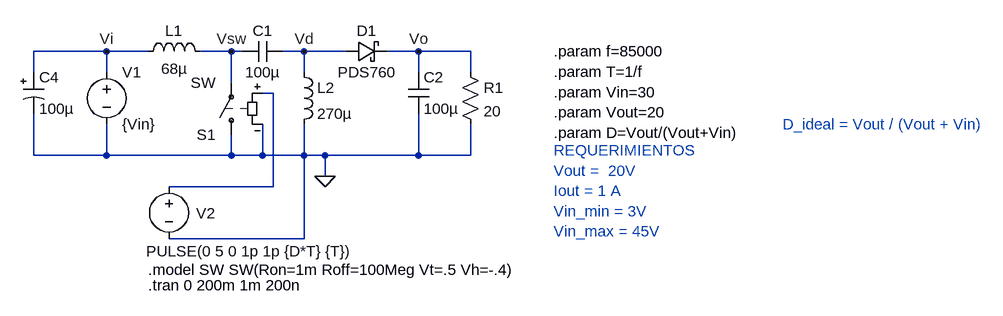
[diagram p0: schematic sepic_20W_3.asc]
sepic_20W_3.asc, the LTspice schematic file:
Version 4.1
SHEET 1 1356 680
WIRE -32 96 -144 96
WIRE 32 96 -32 96
WIRE 160 96 112 96
WIRE 176 96 160 96
WIRE 272 96 240 96
WIRE 336 96 272 96
WIRE 448 96 400 96
WIRE 528 96 448 96
WIRE -144 128 -144 96
WIRE -32 128 -32 96
WIRE 272 128 272 96
WIRE 448 128 448 96
WIRE 528 128 528 96
WIRE 160 144 160 96
WIRE 224 160 208 160
WIRE -144 256 -144 192
WIRE -32 256 -32 208
WIRE -32 256 -144 256
WIRE 160 256 160 224
WIRE 160 256 -32 256
WIRE 208 256 208 208
WIRE 208 256 160 256
WIRE 272 256 272 208
WIRE 272 256 208 256
WIRE 304 256 272 256
WIRE 448 256 448 192
WIRE 448 256 304 256
WIRE 528 256 528 208
WIRE 528 256 448 256
WIRE 304 288 304 256
WIRE 224 304 224 160
WIRE 224 304 64 304
WIRE 272 384 272 256
WIRE 272 384 64 384
FLAG 304 288 0
FLAG 448 96 Vo
FLAG -32 96 Vi
FLAG 160 96 Vsw
FLAG 272 96 Vd
SYMBOL voltage -32 112 R0
WINDOW 123 0 0 Left 0
WINDOW 39 0 0 Left 0
SYMATTR InstName V1
SYMATTR Value {Vin}
SYMBOL res 512 112 R0
SYMATTR InstName R1
SYMATTR Value 20
SYMBOL ind 16 112 R270
WINDOW 0 32 56 VTop 2
WINDOW 3 5 56 VBottom 2
SYMATTR InstName L1
SYMATTR Value 68µ
SYMATTR SpiceLine Rser=1m
SYMBOL ind 256 112 R0
SYMATTR InstName L2
SYMATTR Value 270µ
SYMATTR SpiceLine Rser=1m
SYMBOL schottky 336 112 R270
WINDOW 0 32 32 VTop 2
WINDOW 3 0 32 VBottom 2
SYMATTR InstName D1
SYMATTR Value PDS760
SYMATTR Description Diode
SYMATTR Type diode
SYMBOL cap 240 80 R90
WINDOW 0 0 32 VBottom 2
WINDOW 3 32 32 VTop 2
SYMATTR InstName C1
SYMATTR Value 100µ
SYMBOL voltage 64 288 R0
WINDOW 0 42 57 Left 2
WINDOW 3 -35 115 Left 2
WINDOW 123 0 0 Left 0
WINDOW 39 0 0 Left 0
SYMATTR InstName V2
SYMATTR Value PULSE(0 5 0 1p 1p {D*T} {T})
SYMBOL sw 160 240 R180
SYMATTR InstName S1
SYMBOL polcap -160 128 R0
SYMATTR InstName C4
SYMATTR Value 100µ
SYMATTR Description Capacitor
SYMATTR Type cap
SYMATTR SpiceLine V=25 Irms=1.29 Rser=0.15 Lser=0 mfg="Vishay" pn="TR3W107M025" type="Tantalum"
SYMBOL cap 432 128 R0
SYMATTR InstName C2
SYMATTR Value 100µ
TEXT 32 456 Left 2 !.tran 0 200m 1m 200n
TEXT 32 432 Left 2 !.model SW SW(Ron=1m Roff=100Meg Vt=.5 Vh=-.4)
TEXT 656 96 Left 2 !.param f=85000\n.param T=1/f\n.param Vin=30\n.param Vout=20\n.param D=Vout/(Vout+Vin)
TEXT 1008 208 Left 2 ;D_ideal = Vout / (Vout + Vin)
TEXT 656 248 Left 2 ;REQUERIMIENTOS\nVout =  20V\nIout = 1 A\nVin_min = 3V\nVin_max = 45V

The netlist it stands for:
* sepic_20W_3.asc
V1 Vi 0 {Vin}
R1 Vo 0 20
L1 Vi Vsw 68µ Rser=1m
L2 Vd 0 270µ Rser=1m
D1 Vd Vo PDS760
C1 Vd Vsw 100µ
V2 N001 0 PULSE(0 5 0 1p 1p {D*T} {T})
S1 0 Vsw N001 0 SW
C4 Vi 0 100µ V=25 Irms=1.29 Rser=0.15 Lser=0 mfg="Vishay" pn="TR3W107M025" type="Tantalum"
C2 Vo 0 100µ
.model D D
.lib standard.dio
.tran 0 200m 1m 200n
.model SW SW(Ron=1m Roff=100Meg Vt=.5 Vh=-.4)
.param f=85000
.param T=1/f
.param Vin=30
.param Vout=20
.param D=Vout/(Vout+Vin)
* D_ideal = Vout / (Vout + Vin)
* REQUERIMIENTOS
* Vout =  20V
* Iout = 1 A
* Vin_min = 3V
* Vin_max = 45V
.backanno
.end